# Altium schematic sheet Sheet1.SchDoc
size A4; SheetNumber: 1; SheetTotal: 2
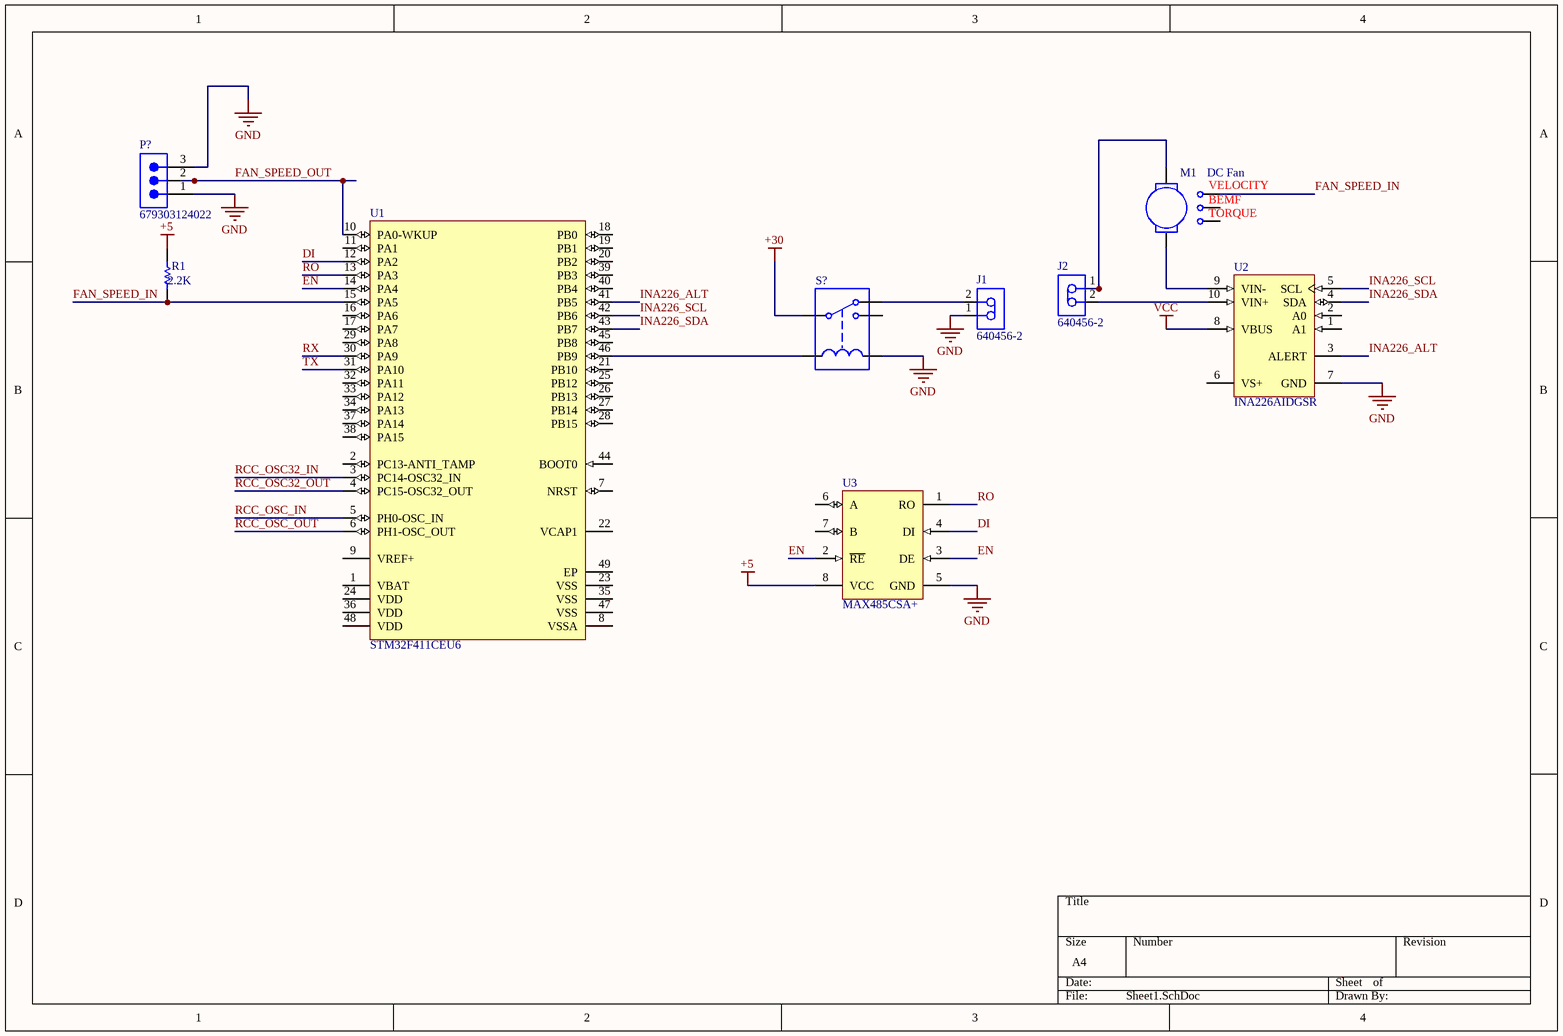
[diagram p0: Sheet1.SchDoc]

## Parts
J1  640456-2  [TECO-640456-2_V]
J2  640456-2  [TECO-640456-2_V]
M1  DC Fan
P?  679303124022  [679303124022]
R1  value 2.2K  (hidden comment: Resistor)
S?  Single-Pole, Double-Throw Relay  (value not drawn)
U1  STM32F411CEU6  [STM-UFQFPN48_L]
U2  INA226AIDGSR  [DGS0010A_L]
U3  MAX485CSA+  [MAXM-MAX485CSA+-8_M]

## Nets
+5: R1.2 U3.8(VCC)
+30: S?.1
GND: J1.1 P?.1 P?.3 S?.5 U2.7(GND) U3.5(GND)
VCC: U2.8(VBUS)
DI: U1.12(PA2) U3.4(DI)
EN: U1.14(PA4) U3.2(~{RE}) U3.3(DE)
FAN_SPEED_IN: M1.3 R1.1 U1.15(PA5)
FAN_SPEED_OUT: P?.2 U1.10(PA0-WKUP)
INA226_ALT: U1.41(PB5) U2.3(ALERT)
INA226_SCL: U1.42(PB6) U2.5(SCL)
INA226_SDA: U1.43(PB7) U2.4(SDA)
RCC_OSC32_IN: U1.3(PC14-OSC32_IN)
RCC_OSC32_OUT: U1.4(PC15-OSC32_OUT)
RCC_OSC_IN: U1.5(PH0-OSC_IN)
RCC_OSC_OUT: U1.6(PH1-OSC_OUT)
RO: U1.13(PA3) U3.1(RO)
RX: U1.30(PA9)
TX: U1.31(PA10)
NetJ1_2: J1.2 S?.3
NetJ2_1: J2.1 M1.1
NetJ2_2: J2.2 U2.10(VIN+)
NetM1_2: M1.2 U2.9(VIN-)
NetS?_4: S?.4 U1.46(PB9)

Not connected (* = marked no-connect by the designer): M1 4 5; S? 2; U1 1(VBAT) 2(PC13-ANTI_TAMP) 7(NRST) 8(VSSA) 9(VREF+) 11(PA1) 16(PA6) 17(PA7) 18(PB0) 19(PB1) 20(PB2) 21(PB10) 22(VCAP1) 23(VSS) 24(VDD) 25(PB12) 26(PB13) 27(PB14) 28(PB15) 29(PA8) 32(PA11) 33(PA12) 34(PA13) 35(VSS) 36(VDD) 37(PA14) 38(PA15) 39(PB3) 40(PB4) 44(BOOT0) 45(PB8) 47(VSS) 48(VDD) 49(EP); U2 1(A1) 2(A0) 6(VS+); U3 6(A) 7(B)

## Notes on the sheet
- (in symbol DC Motor) VELOCITY; BEMF; TORQUE

## Library data of the parts
J1 J2 = CMP-2000-05417-1: Male Header, Pitch 2.54 mm, 1 x 2 Position, Height 10.49 mm, Tail Length 3.556 mm, -55 to 105 degC, RoHS, Bulk; Manufacturer: TE Connectivity; Standards: RoHSCompliant,ELVCompliant,UL94V-0; Material, Housing: Polyester; Agency Approvals: CSA,UL; Brand/Series: MTA-100Series; Contact Centerline Spacing: 0.100 / in.; Material, Contact: CopperAlloy; Current, Rating: 5 / A; Color, Housing: White; Contact Termination Area Plating: Tin; Special Features: Pinstrip; Number of Positions: 2; Pin Spacing: 0.1 / "; Temperature, Operating: -55to+105 / degC; Angle: Straight; Mount Angle: Vertical; Connector Type: MTA-100; Primary Type: InterconnectSystem; Voltage, Rating: 250 / V; Mounting Hole Size: 0.04 / "; Number of Rows: 1; Termination: Solder; Length, Terminal Post: 0.14 / in.; Manufacturer URL: http://www.te.com/; Color: White; Size, Post: 0.025 / in.; Contact Shape: Square; Mounting Type: PCMount; Datasheet URL: https://datasheet.ciiva.com/11746/0900766b80eb7fdd-11746365.pdf; Type: PCBPlug; Datasheet Version: Rev. W, 06/2004; Number of Contacts: 2; Flammability Rating: UL94V-0; Contact Plating: Tin; Length, Pin: 0.14 / "; Contact Mating Area Plating: Tin; Length, Overall: 0.2 / "
M1 = DC Motor: LA: 1.5M; RA: 0.5; KE: 0.05; JM: 250U; BM: 0.1M; TL: 0; SimulationGenericComponent: True; KT: 0.05
P? = CMP-1502-00722-2: NexarPartId: 18818282; Insulation: Insulated; Operating Supply Voltage: 50V; Number of Contacts: 3; Current Rating: 1A; Insulation Resistance: 100MΩ; Gender: Male; Contact Resistance: 20mΩ; Connector Type: Male Pin; Pitch: 1.5mm; Number of Pins: 3; Flammability Rating: UL94 V-0; Lead Pitch: 1.5mm; Max Operating Temperature: 85°C; Contact Plating: Tin; Contact Gender: Male; Height: 5mm; Contact Material: Copper; Mount: Surface Mount; Termination: SMD/SMT; Number of Positions: 3; Color: Beige, White; Length: 7.5mm; Voltage Rating: 50V; Packaging: Tape and Reel; RoHS: Compliant; Housing Material: Nylon; Width: 7.5mm; Number of Rows: 1; Orientation: Vertical; REACH SVHC: No SVHC; Min Operating Temperature: -25°C
R1 = Resistor: TC1: 0; SimulationGenericComponent: True; TC2: 0
S? = SPDT Relay: L_C: 1u; R_C: 100; RON: 1; ROFF: 1e12; ION: 1m; IOFF: 0; SimulationGenericComponent: True
U1 = CMP-0243-00165-1: ARM Cortex-M4 32-bit MCU+FPU, 512 KB Flash, 128 KB RAM, 36 I/Os, 48-Pin UFQFPN, -40 to 85 degC, Tray; Operating Frequency(F) (Processor speed) (MHz): 100; FLASH Size (Prog) (kB): 512; Internal RAM Size (kB): 128; I/Os (High Current): 36; Supply Voltage(Vcc) min (V): 1.7; Package Reference: 48-Pin Ultra Thin Fine Pitch Quad Flat No-Lead, 7 x 7 x 0.6 mm Body, 0.5 mm Pitch, Exposed Pad; ComponentLink1Description: Manufacturer URL; ComponentLink1URL: http://www.st.com/; Packing: Tray; Package Description: UFQFPN48; Core: ARM Cortex-M4; ComponentLink2Description: Datasheet; ComponentLink2URL: http://www.st.com/st-web-ui/static/active/en/resource/technical/document/datasheet/DM00115249.pdf; DatasheetVersion: Rev. 6; Mounting Technology: Surface Mount
U2 = CMP-0704-00058-2: High-Side Measurement, Bi-Directional Current / Power Monitor with I2C Interface, 2.7 to 5.5 V, -40 to 125 degC, 10-pin SOP (DGS10), Green (RoHS & no Sb/Br); Vs(Max)(V): 5.5; CMRR(Min)(dB): 126; Rating: Catalog; Input Offset (+/-)(Max)(uV): 10; Small-Signal Bandwidth(Typ)(MHz): 0.007; Input Offset Drift (+/-)(Max)(uV/Degrees Celsius): 0.1; Common Mode Range(Max)(V): 36; Gain(V/V): 1; SubFamily: Current Shunt Monitor; Quiescent Current (+/-)(Typ)(mA): 0.33; Vs(Min)(V): 2.7; Common Mode Range(Min)(V): 0; ComponentLink2URL: http://www.ti.com/general/docs/lit/getliterature.tsp?genericPartNumber=INA226&fileType=pdf; ComponentLink1URL: http://www.ti.com/; PartNumber: INA226AIDGSR; Mounting Technology: Surface Mount; PackageDescription: 10-Pin Plastic Small Outline, Body 3 x 3 mm, Pitch 0.5 mm; ComponentLink3Description: Package Specification; Code_JEDEC: MO-153; Eco-Plan: Green (RoHS & no Sb/Br); PackageReference: DGS0010A; ComponentLink2Description: Datasheet; ComponentLink3URL: http://www.ti.com/lit/ml/mpds035b/mpds035b.pdf; ComponentLink1Description: Manufacturer URL; DatasheetVersion: SBOS547; PackageVersion: 4073272/C, 02/2004
U3 = CMP-2000-05211-1: Low-Power, Slew-Rate-Limited RS-485/RS-422 Transceiver, 4.75 to 5.25 V, 0 to 70 degC, 8-Pin SOIC, RoHS, Tape and Reel; Manufacturer: Maxim; No. of Receivers: 1; Transceiver Type: Differential; Supply Voltage Min: 4.75V; IC Generic Number: 485; IC Temperature Range: Commercial; No. of Pins: 8; Supply Voltage Range: 4.75Vto5.25V; Interface: RS-422/RS-485; Supply Voltage Max: 5.25V; Data Rate: 2.5Mbps; Line / Bus Driver / Receiver / Transceiver Type: CMOSDifferential; Supply Current: 500µA; Interface Type: RS422,RS485; Device Type: Transceiver; Manufacturer URL: http://www.maximintegrated.com/; Operating Temperature Range: 0degCto+70degC; Package / Case: SOIC; Digital IC Case Style: SOIC; Operating Temperature Max: 70degC; Device Marking: MAX485CSA+; Driver Case Style: SOIC; Datasheet Version: Rev. 8, 10/2003; Operating Temperature Min: 0degC; Datasheet URL: https://datasheet.ciiva.com/29306/170071-da-01-en-ic-max485csa-so8-29306144.pdf; Base Number: 485; No. of Drivers: 1; Logic Function Number: 485